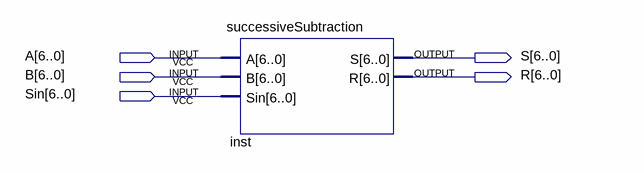
[diagram p0: schematic sheet]
// Quartus schematic testSuccessiveSubtraction.bdf as structural Verilog: 1 symbols, 5 pins
module testSuccessiveSubtraction (
  input  [6:0] A,
  input  [6:0] B,
  input  [6:0] Sin,
  output [6:0] S,
  output [6:0] R
);

  successiveSubtraction inst (.A(A), .B(B), .Sin(Sin), .S(S), .R(R));
endmodule
